# EAGLE design SOFTWEAR_microbit (EAGLE 9.4.2)
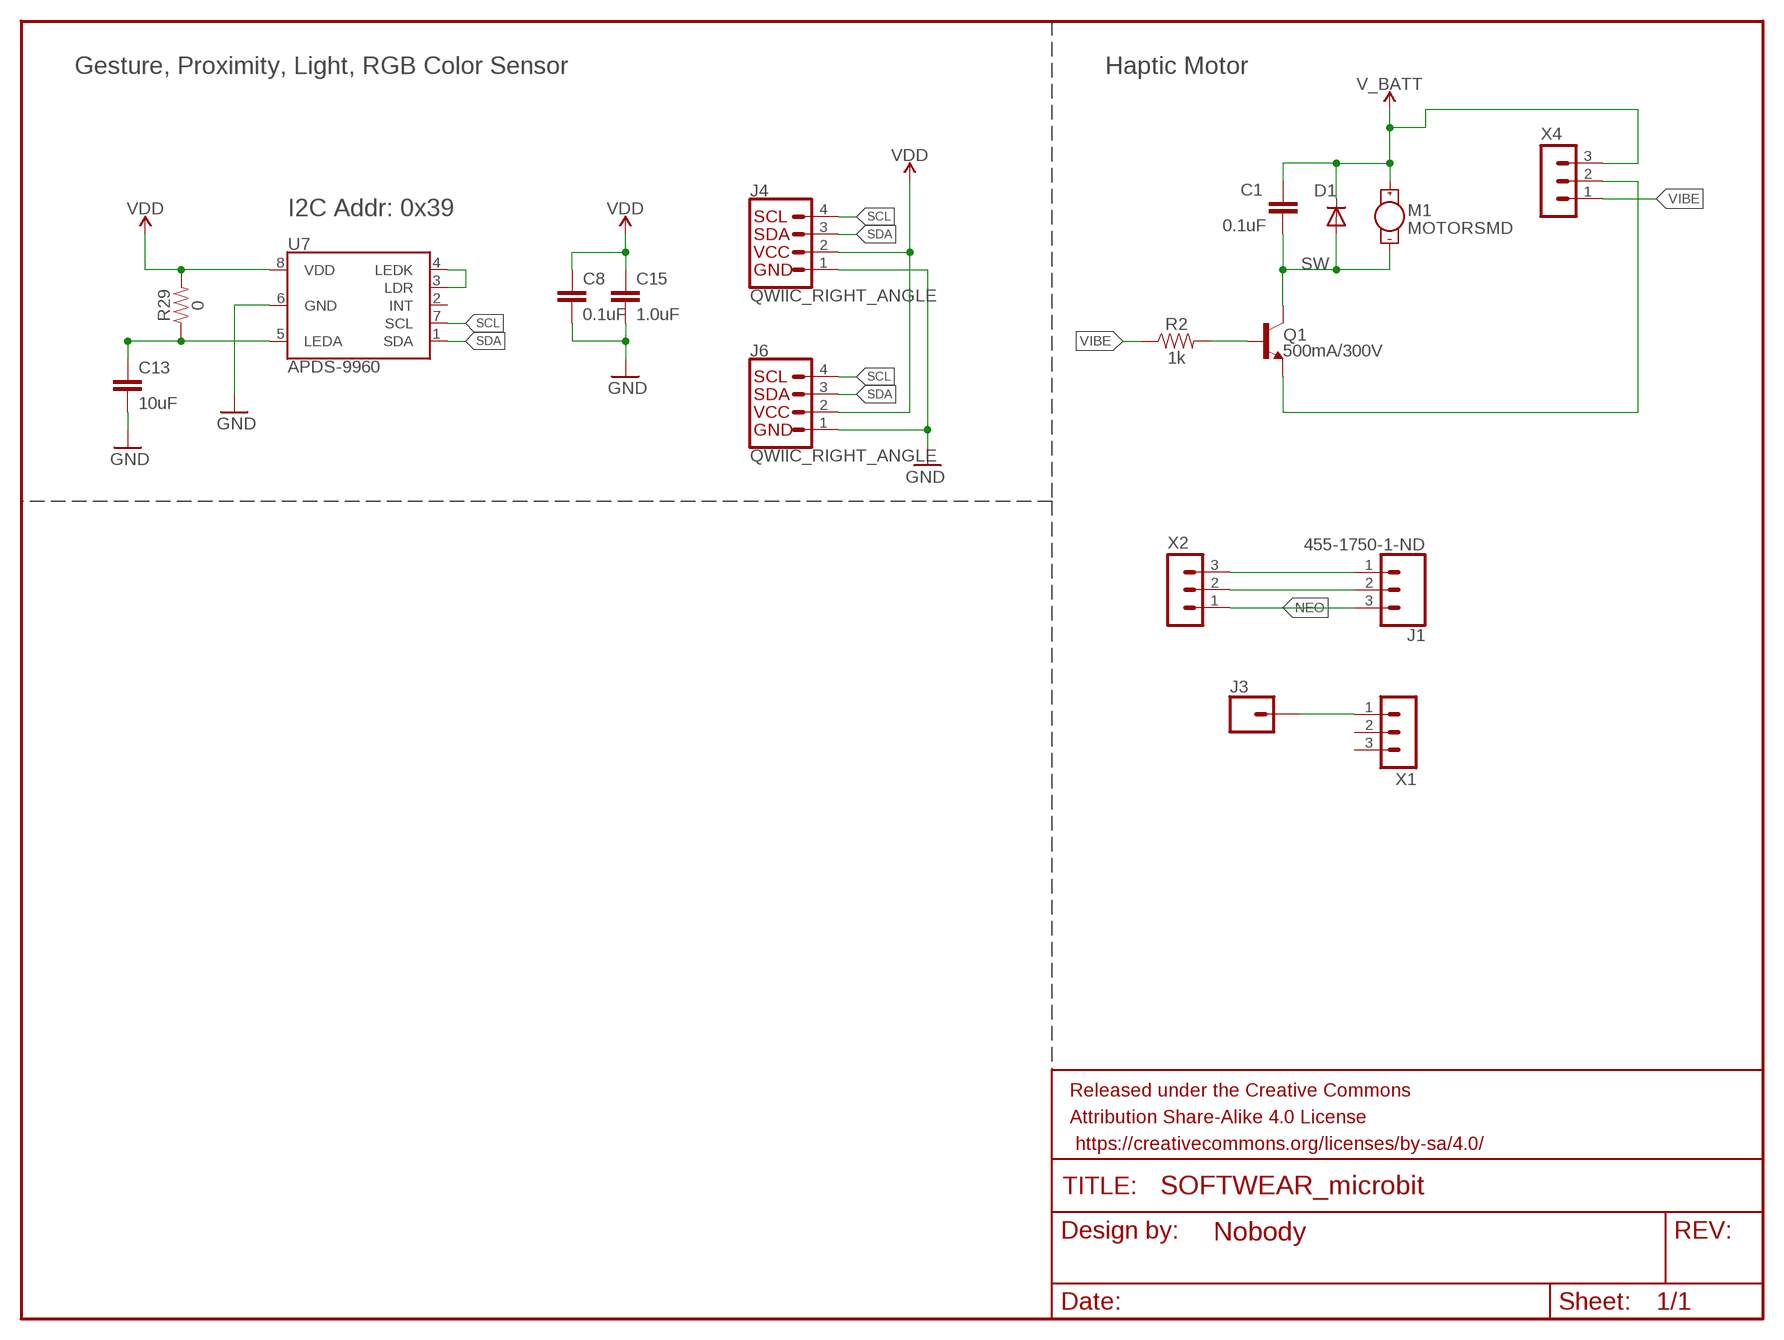
[diagram p0: schematic, sheet 1]

## Parts
C1  0.1uF  0.1UF-0603-25V-(+80/-20%)  [0603]
C8  0.1uF  0.1UF-0603-25V-(+80/-20%)  [0603]
C13  10uF  10UF-0805-10V-10%  [0805]
C15  1.0uF  1.0UF-0603-16V-10%  [0603]
D1  DIODESOD  [SOD-323]
FRAME2  FRAME-LETTERNO_PACKAGE  [DUMMY]
J1  455-1750-1-ND  CONN_03  [1X03]
J3  CONN_01SPRING-CONN  [SPRING-CONNECTOR]
J4  QWIIC_RIGHT_ANGLE  QWIIC_CONNECTORJS-1MM  [JST04_1MM_RA]
J6  QWIIC_RIGHT_ANGLE  QWIIC_CONNECTORJS-1MM  [JST04_1MM_RA]
M1  MOTORSMD  [VIBE-MOTOR-10MM-SMD]
Q1  500mA/300V  TRANS_NPN-MMBTA42  [SOT23-3]
R2  1k  1KOHM-0603-1/10W-1%  [0603]
R29  0  0OHM-0603-1/10W-5%  [0603]
U7  APDS-9960  [APDS-9960]
X1  SM03B-SRSS-TB  [SM03B-SRSS-TB]
X2  SM03B-SRSS-TB  [SM03B-SRSS-TB]
X4  SM03B-SRSS-TB  [SM03B-SRSS-TB]

## Nets
GND: C8.2 C13.2 C15.2 J4.1 J6.1 U7.6(GND)
LEDA: C13.1 R29.1 U7.5(LEDA)
N$2: Q1.1(B) R2.2
N$4: J1.2 X2.2
N$5: U7.3(LDR) U7.4(LEDK)
N$6: J3.P$2 X1.1
N$7: J1.1 X2.3
N$8: Q1.2(E) X4.2
NEO: J1.3 X2.1
SCL: J4.4 J6.4 U7.7(SCL)
SDA: J4.3 J6.3 U7.1(SDA)
SW: C1.2 D1.2(A) M1.P$2(-) Q1.3(C)
V_BATT: C1.1 D1.1(C) M1.P$1(+) X4.3
VDD: C8.1 C15.1 J4.2 J6.2 R29.2 U7.8(VDD)
VIBE: R2.1 X4.1
Unconnected: U7.2(INT) X1.2 X1.3

## Notes on the sheet
- Gesture, Proximity, Light, RGB Color Sensor | Haptic Motor
- I2C Addr: 0x39

## Library data of the parts
C1 C8 = SparkFun-Capacitors:0.1UF: 0.1µF ceramic capacitors A capacitor is a passive two-terminal electrical component used to store electrical energy temporarily in an electric field.; PROD_ID: CAP-00810
C13 = SparkFun-Capacitors:10UF: 10.0µF ceramic capacitors A capacitor is a passive two-terminal electrical component used to store electrical energy temporarily in an electric field.; PROD_ID: CAP-11330
C15 = SparkFun-Capacitors:1.0UF: 1µF ceramic capacitors A capacitor is a passive two-terminal electrical component used to store electrical energy temporarily in an electric field.; PROD_ID: CAP-00868
D1 = SparkFun:DIODE: Diode These are standard reverse protection diodes and small signal diodes. SMA package can handle up to about 1A. SOD-323 can handle about 200mA. What the SOD-323 package when ordering, there are some mfgs out there that are 5-pin packages.
FRAME2 = SparkFun-Aesthetics:FRAME-LETTER: Schematic Frame - Letter Standard 8.5x11 US Letter frame; DESIGNER: Nobody; VERSION: v01
J1 = SparkFun-Connectors:CONN_03: Multi connection point. Often used as Generic Header-pin footprint for 0.1 inch spaced/style header connections On any of the 0.1 inch spaced packages, you can populate with these: Break Away Headers - Straight <https://www.sparkfun.com/products/116> (PRT-00116) Break Away Male Headers - Right Angle <https://www.sparkfun.com/products/553> (PRT-00553) Female Headers <https://www.sparkfun.com/products/115> (PRT-00115) Break Away Headers - Machine Pin <https://www.sparkfun.com/products/117> (PRT-00117) Break Away Female Headers - Swiss Machine Pin <https://www.sparkfun.com/products/743> (PRT-00743) Stackable Header - 3 Pin (Female, 0.1") <https://www.sparkfun.com/products/13875> (PRT-13875) For SCREWTERMINALS and SPRING TERMINALS visit here: Screw Terimnals on SparkFun.com <https://www.sparkfun.com/search/results?term=Screw+Terminals> (5mm/3.5mm/2.54mm spacing) This device is also useful as a general connection point to wire up your design to another part of your project. Our various solder wires solder well into these plated through hole pads. Hook-Up Wire - Assortment (Stranded, 22 AWG) <https://www.sparkfun.com/products/11375> (PRT-11375) Hook-Up Wire - Assortment (Solid Core, 22 AWG) <https://www.sparkfun.com/products/11367> (PRT-11367) View the entire wire category on our website here <https://www.sparkfun.com/categories/141> Special notes: Molex polarized connector foot print use with SKU : PRT-08232 with associated crimp pins and housings.; PROD_ID: XXX-00000
J3 = SparkFun-Connectors:CONN_01: Single connection point. Often used as Generic Header-pin footprint for 0.1 inch spaced/style header connections On any of the 0.1 inch spaced packages, you can populate with these: Break Away Headers - Straight <https://www.sparkfun.com/products/116> (PRT-00116) Break Away Male Headers - Right Angle <https://www.sparkfun.com/products/553> (PRT-00553) Female Headers <https://www.sparkfun.com/products/115> (PRT-00115) Break Away Headers - Machine Pin <https://www.sparkfun.com/products/117> (PRT-00117) Break Away Female Headers - Swiss Machine Pin <https://www.sparkfun.com/products/743> (PRT-00743) This device is also useful as a general connection point to wire up your design to another part of your project. Our various solder wires solder well into these plated through hole pads. Hook-Up Wire - Assortment (Stranded, 22 AWG) <https://www.sparkfun.com/products/11375> (PRT-11375) Hook-Up Wire - Assortment (Solid Core, 22 AWG) <https://www.sparkfun.com/products/11367> (PRT-11367) View the entire wire category on our website here <https://www.sparkfun.com/categories/141> Special notes: SMTSO-256-ET is a "flush mount" nut for a 4-40 screw. We mostly use this on specialty testbeds; it is a nice way to connect hardware to your PCB at an adjustable hieght. Also note, the SNAP packages are for using a snappable style connector. We sell a baggie of snaps and they are also used on two LilyPad designs: Snap Assortment - 30 pack (male and female) <https://www.sparkfun.com/products/11347> (DEV-11347) LilyPad Arduino SimpleSnap <https://www.sparkfun.com/products/10941> (DEV-10941) LilyPad SimpleSnap Protoboard <https://www.sparkfun.com/products/10940> (DEV-10940); SF_ID: PRT-11822
J4 J6 = SparkFun-Connectors:QWIIC_CONNECTOR: SparkFun I2C Standard Qwiic Connector An SMD 1mm pitch JST connector makes it easy and quick (get it? Qwiic?) to connect I2C devices to each other. The Qwiic system <http://www.sparkfun.com/qwiic> enables fast and solderless connection between popular platforms and various sensors and actuators. We carry 200mm <https://www.sparkfun.com/products/14204>, 100mm <https://www.sparkfun.com/products/14205>, 50mm <https://www.sparkfun.com/products/14206>, and breadboard friendly <https://www.sparkfun.com/products/14207> Qwiic cables. We also offer 10 pcs strips <https://www.sparkfun.com/products/14323> the SMD connectors.; PROD_ID: CONN-13694
M1 = Testing:MOTOR: Vibration Motor Physical dimension and wire connections for this powerful vibration motor. Motor has a self adhesive backing. Spark Fun Electronics SKU : ROB-08449
Q1 = SparkFun-DiscreteSemi:TRANS_NPN: NPN transistor Current controlled devices typically used to amplify current or used as a switch. BC547 - COM-08928 <http://www.sparkfun.com/products/8928> (TO-92 45V 100mA) (1.Collector 2.Base 3.Emitter) 2N3904 - COM-00521 <http://www.sparkfun.com/products/521> (TO-92 40V 200mA) (1.Emitter 2.Base 3.Collector) P2N2222A - COM-12852 <http://www.sparkfun.com/products/12852> (TO-92 40V 600mA) (1.Collector 2.Base 3.Emitter); PROD_ID: TRANS-09116
R2 = SparkFun-Resistors:1KOHM: 1kΩ resistor A resistor is a passive two-terminal electrical component that implements electrical resistance as a circuit element. Resistors act to reduce current flow, and, at the same time, act to lower voltage levels within circuits. - Wikipedia; PROD_ID: RES-07856
R29 = SparkFun-Resistors:0OHM: 0Ω resistor A resistor is a passive two-terminal electrical component that implements electrical resistance as a circuit element. Resistors act to reduce current flow, and, at the same time, act to lower voltage levels within circuits. - Wikipedia; PROD_ID: RES-08609
U7 = SparkFun-Sensors:APDS-9960: Avago APDS-9960 Digital Proximity, Ambient Light, RGB, and Gesture Sensor. The APDS-9960 offers ambient light and color measuring, proximity detection, and touchless gesture sensing. It features UV and IR blocking filters, four separate diodes sensitive to different directions, and an I2C compatible interface. Datasheet <https://cdn.sparkfun.com/datasheets/Sensors/Proximity/apds9960.pdf> SparkFun Products SparkFun RGB and Gesture Sensor - APDS-9960 <https://www.sparkfun.com/products/12787> (SEN-12787); PROD_ID: SEN-12005
X1 X2 X4 = con-JST SH (1):SM03B-SRSS: JST SH series header 1.00mm pitch disconnectable crimp style connectors, horizontal (side entry type), 3 pins

## Net classes
1 power: width 0.305 mm

## Board
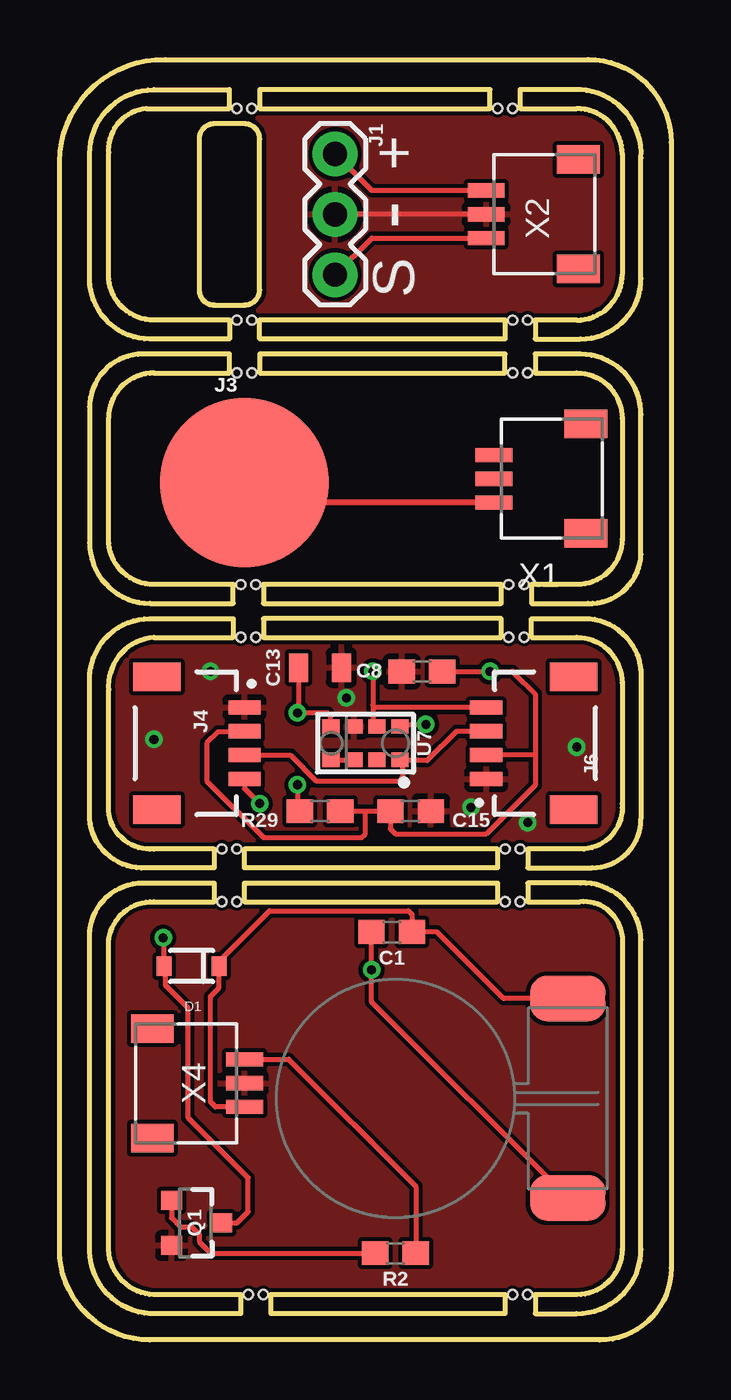
[diagram p1: board, top side]
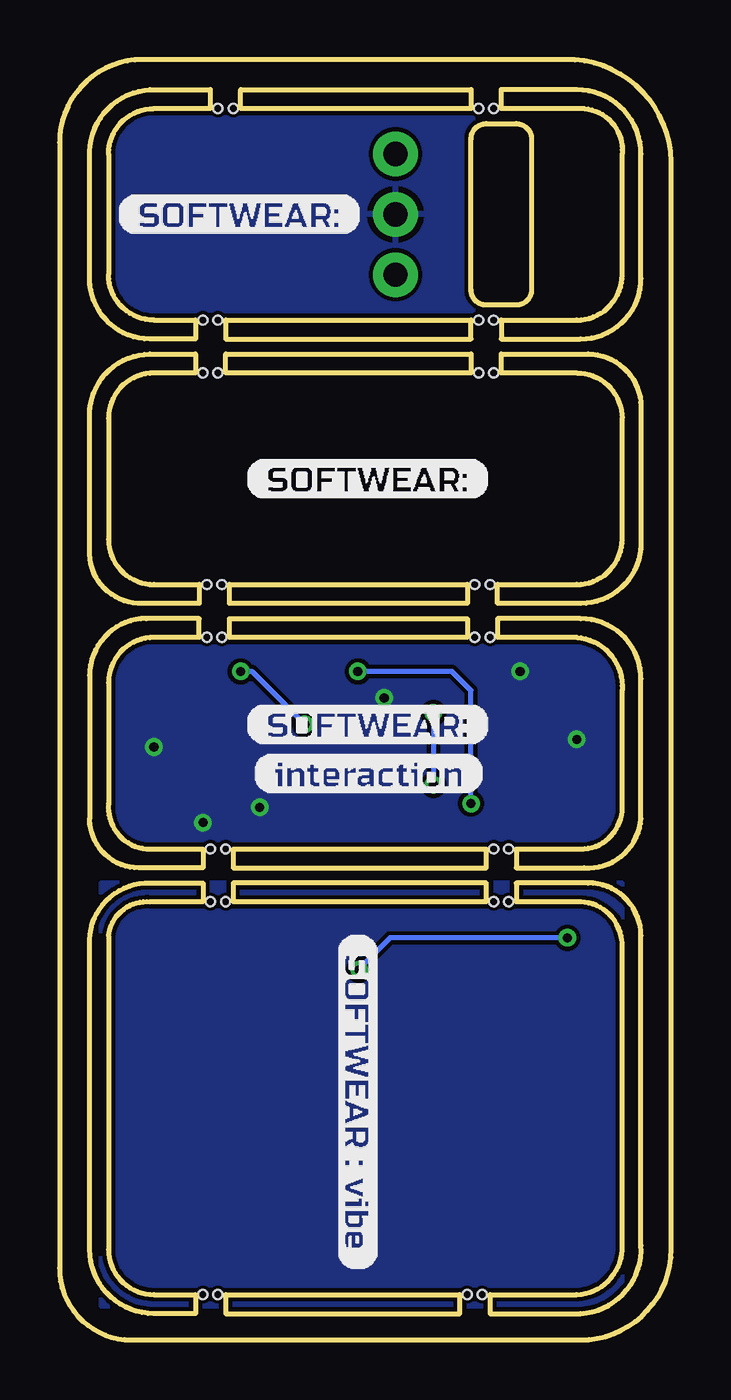
[diagram p2: board, bottom side, seen from below]

Size 25.72 x 53.82 mm. Coordinates in mm from the lower left corner, seen from the top.
Outline: 23.65,16.99 23.65,3.81 arc-90 21.75,1.91 20,1.91 20,1.11 21.75,1.11 arc90 24.45,3.81 24.45,16.83 arc90 21.91,19.21 19.69,19.21 19.69,18.42 21.89,18.42 arc-90 23.65,16.99
Outline: 2.06,3.97 2.06,16.67 arc-90 3.97,18.42 6.51,18.42 6.51,19.21 3.49,19.21 arc90 1.27,16.99 1.27,3.97 arc90 3.81,1.11 7.62,1.11 7.62,1.91 3.97,1.91 arc-90 2.06,3.97
Outline: 8.41,44.13 8.41,50.48 arc90 7.78,51.12 6.51,51.12 arc90 5.87,50.48 5.87,44.13 arc90 6.51,43.5 7.78,43.5 arc90 8.41,44.13
Outline: 2.06,33.66 2.06,38.74 arc-90 3.97,40.64 7.14,40.64 7.14,41.43 3.49,41.43 arc90 1.27,39.21 1.27,33.5 arc90 3.81,30.96 7.3,30.96 7.3,31.75 3.97,31.75 arc-90 2.06,33.66
Outline: 23.65,38.74 23.65,33.66 arc-90 21.75,31.75 19.84,31.75 19.84,30.96 22.23,30.96 arc90 24.45,33.02 24.45,38.89 arc90 21.91,41.43 20,41.43 20,40.64 21.75,40.64 arc-90 23.65,38.74
Outline: 2.06,44.77 2.06,49.85 arc-90 3.65,51.75 7.14,51.75 7.14,52.55 3.97,52.55 arc90 1.27,49.85 1.27,44.61 arc90 3.81,42.07 7.14,42.07 7.14,42.86 3.97,42.86 arc-90 2.06,44.77
Outline: 23.65,49.85 23.65,44.77 arc-90 21.75,42.86 20,42.86 20,42.07 21.91,42.07 arc90 24.45,44.61 24.45,49.69 arc90 21.91,52.55 19.37,52.55 19.37,51.75 21.75,51.75 arc-90 23.65,49.85
Outline: 21.75,29.53 arc-90 23.65,27.62 23.65,22.54 arc-90 22.07,20.64 19.69,20.64 19.69,19.84 22.38,19.84 arc90 24.45,21.91 24.45,27.94 arc90 22.07,30.32 19.84,30.32 19.84,29.53 21.75,29.53
Outline: 3.97,20.64 arc-90 2.06,22.23 2.06,27.31 arc-90 3.97,29.53 7.3,29.53 7.3,30.32 3.81,30.32 arc90 1.27,27.78 1.27,21.91 arc90 3.65,19.84 6.51,19.84 6.51,20.64 3.97,20.64
Outline: 18.73,1.91 8.89,1.91 8.89,1.11 18.73,1.11 18.73,1.91
Outline: 7.78,18.42 18.42,18.42 18.42,19.21 7.78,19.21 7.78,18.42
Outline: 18.42,20.64 7.78,20.64 7.78,19.84 18.42,19.84 18.42,20.64
Outline: 8.57,29.53 18.57,29.53 18.57,30.32 8.57,30.32 8.57,29.53
Outline: 18.57,31.75 8.57,31.75 8.57,30.96 18.57,30.96 18.57,31.75
Outline: 8.41,40.64 18.73,40.64 18.73,41.43 8.41,41.43 8.41,40.64
Outline: 18.73,42.86 8.41,42.86 8.41,42.07 18.73,42.07 18.73,42.86
Outline: 8.41,51.75 18.1,51.75 18.1,52.55 8.41,52.55 8.41,51.75
Outline: 4.45,53.82 22.23,53.82 arc-90 25.72,50.32 25.72,3.02 arc-90 22.7,0 3.81,0 arc-90 0,3.81 0,49.53 arc-90 4.45,53.82
Copper layers (1*16): Top 0.035mm / dielectric 1.5mm / Bottom 0.035mm
Design rules "SparkFun-2-layer-TIGHT": minimum track width 7mil, minimum drill 15mil, track to track 7mil, track to pad 7mil, pad to pad 7mil, via to via 7mil, smd to smd 7mil, copper to edge 7mil, drill to drill 7mil, minimum pad ring 7mil, minimum via ring 7mil, stop-mask expansion 4mil, vias tented up to drill 25mil, thermal gap 10mil
Holes 0.38 mm at 19.69,1.91 19.05,1.91 8.57,1.91 7.94,1.91 18.73,18.41 19.37,18.41 6.83,18.41 7.46,18.41 19.37,20.64 18.73,20.64 7.46,20.64 6.83,20.64 19.53,29.53 18.89,29.53 19.53,31.75 18.89,31.75 8.26,29.53 7.62,29.53 19.69,40.64 19.05,40.64 8.1,40.64 7.46,40.64 7.62,31.75 8.26,31.75 8.1,42.86 7.46,42.86 19.69,42.86 19.05,42.86 19.05,51.75 18.41,51.75 8.1,51.75 7.46,51.75

### Footprints (pad centres in the part's own frame; a part is rotated, then mirrored left to right if it is on the bottom)
0603 = smd 1.1 x 1: 1 -0.85,0; 2 0.85,0
0805 = smd 0.8 x 1.2: 1 -0.9,0; 2 0.9,0
SOD-323 = smd 0.63 x 0.83: 1 -1.15,0; 2 1.15,0
1X03 = drill 1.016 pad 1.88: 1 0,0; 2 2.54,0; 3 5.08,0
SPRING-CONNECTOR = smd 7.112 x 7.112: P$2 0,0
JST04_1MM_RA = smd 0.6 x 1.35: 1 -1.5,0; 2 -0.5,0; 3 0.5,0; 4 1.5,0 | smd 1.2 x 2: NC1 2.8,-3.675; NC2 -2.8,-3.675
VIBE-MOTOR-10MM-SMD = smd 1.905 x 3.175: P$1 4.191,-7.239; P$2 -4.191,-7.239
SOT23-3 = smd 0.8 x 0.9: 1 -0.95,-1; 2 0.95,-1; 3 0,1.1
APDS-9960 = smd 0.6 x 0.72: 1 0.7,1.455; 2 0.7,0.485; 3 0.7,-0.485; 4 0.7,-1.455; 5 -0.7,-1.455; 6 -0.7,-0.485; 7 -0.7,0.485; 8 -0.7,1.455
SM03B-SRSS-TB = smd 0.6 x 1.55: 1 1,0; 2 0,0; 3 -1,0 | smd 1.2 x 1.8: M1 2.3,3.875; M2 -2.3,3.875

### Placement (x,y rotation side)
C1  13.97,17.14 180 top
C8  15.24,28.1 180 top
C13  10.95,28.26 0 top
C15  14.76,22.22 0 top
D1  5.56,15.72 180 top
FRAME2  8.73,36.83 270 top
J1  11.59,49.85 270 top
J3  7.78,36.04 0 top
J4  7.78,25.08 270 top
J6  17.94,25.08 90 top
M1  14.13,10.16 90 top
Q1  5.71,4.92 270 top
R2  14.13,3.65 180 top
R29  10.95,22.22 0 top
U7  12.86,25.08 270 top
U$1  [SOFTWEAR#3]  23.34,47.31 0 bottom
U$2  [INTERACTION1]  17.62,23.81 0 bottom
U$4  [SOFTWEAR#3]  17.94,36.2 0 bottom
U$5  [SOFTWEAR_#_VIBE6]  13.18,17.14 270 bottom
U$6  [SOFTWEAR#3]  17.94,25.88 0 bottom
X1  18.26,36.2 270 top
X2  17.94,47.31 270 top
X4  7.78,10.8 90 top

### Tracks (layer width: path | path; a pad name or v marks a point on that pad's centre or on a via)
GND  (via drill 0.38)
  other vias: 17.3,22.38 21.75,24.92 19.69,21.75 6.35,28.1 3.97,25.24 12.06,26.99
  pour Top: 2.22,30.16 23.97,30.16 23.97,20.16 2.22,20.16
  pour Bottom: 2.22,30.16 23.97,30.16 23.97,20.16 2.22,20.16
LEDA  (via drill 0.38)
  Top 0.203: C13.1 10.05,26.41 v10,26.35 11.27,26.35 11.4,26.22 U7.5 | v10,23.34 10,22.33 R29.1
  Bottom 0.203: v10,26.35 v10,23.34
N$2
  Top 0.203: Q1.1 4.72,5.13 5.08,4.76 5.56,4.76 5.87,4.45 5.87,4.13 6.35,3.65 R2.2
N$4
  Top 0.203: X2.2 J1.2
  pour Top: 1.91,42.55 23.97,42.55 23.97,52.39 1.91,52.39 1.91,51.91
  pour Bottom: 2.7,52.55 23.97,52.55 23.97,42.55 2.7,42.55
N$5
  Top 0.203: U7.4 U7.3
N$6
  Top 0.254: X1.1 9.1,35.2 7.78,36.51 7.3,36.51 J3.P$2
N$7
  Top 0.203: X2.3 13.13,48.31 J1.1
N$8
  pour Bottom: 2.22,19.21 23.97,19.21 23.97,1.43 2.86,1.43 2.54,1.43 2.38,1.43 2.06,1.43 2.06,19.21
  pour Top: 2.06,19.21 23.97,19.21 23.97,1.43 2.06,1.43
NEO
  Top 0.203: J1.3 13.13,46.31 X2.1
SCL  (via drill 0.38)
  Top 0.203: J4.4 7.78,23.18 v8.41,22.54 | v13.18,28.1 13.18,26.67 | 13.18,26.67 13.18,25.95 U7.7 | J6.4 13.26,26.58 13.18,26.67
  Bottom 0.203: v8.41,22.54 8.41,27.31 9.21,28.1 v13.18,28.1
SDA
  Top 0.203: J4.3 9.71,24.58 10.8,23.5 14.29,23.5 14.45,23.65 14.45,24.25 14.35,24.35 | 14.35,24.35 U7.1 | J6.3 16.69,25.58 15.46,24.35 14.35,24.35
SW  (via drill 0.38)
  Top 0.203: M1.P$2 13.12,14.22 v13.12,15.56 C1.2 | v4.37,16.91 4.45,16.83 4.41,16.79 D1.2 4.45,15.68 4.45,14.92 5.4,13.97 5.4,9.37 7.94,6.83 7.94,5.4 7.46,4.92 Q1.3
  Bottom 0.203: v4.37,16.91 11.83,16.91 13.18,15.56 v13.12,15.56
V_BATT
  Top 0.203: M1.P$1 18.67,14.35 15.88,17.15 C1.1 14.82,17.88 14.67,18.03 8.83,18.03 6.71,15.91 D1.1 6.71,14.8 6.35,14.45 6.35,10 6.56,9.8 X4.3
VDD  (via drill 0.38)
  Top 0.203: R29.2 12.86,22.23 | 12.86,22.23 C15.1 13.91,21.49 14.13,21.27 17.94,21.27 20,23.34 20,24.58 | J4.2 7.76,25.56 6.67,25.56 6.19,25.08 6.19,23.5 8.57,21.11 12.7,21.11 12.86,21.27 12.86,22.23 | C8.1 v18.1,28.1 19.05,28.1 20,27.15 20,24.58 | 20,24.58 J6.2 | U7.8 14.41,25.88 v15.4,25.88
  Bottom 0.203: v15.4,25.88 17.62,28.1 v18.1,28.1
VIBE
  Top 0.203: X4.1 9.64,11.8 14.98,6.45 R2.1

### Text on the board
tPlace: + | - | S